# Altium schematic sheet 12V_POWER_BULKHEAD.SchDoc
size A4
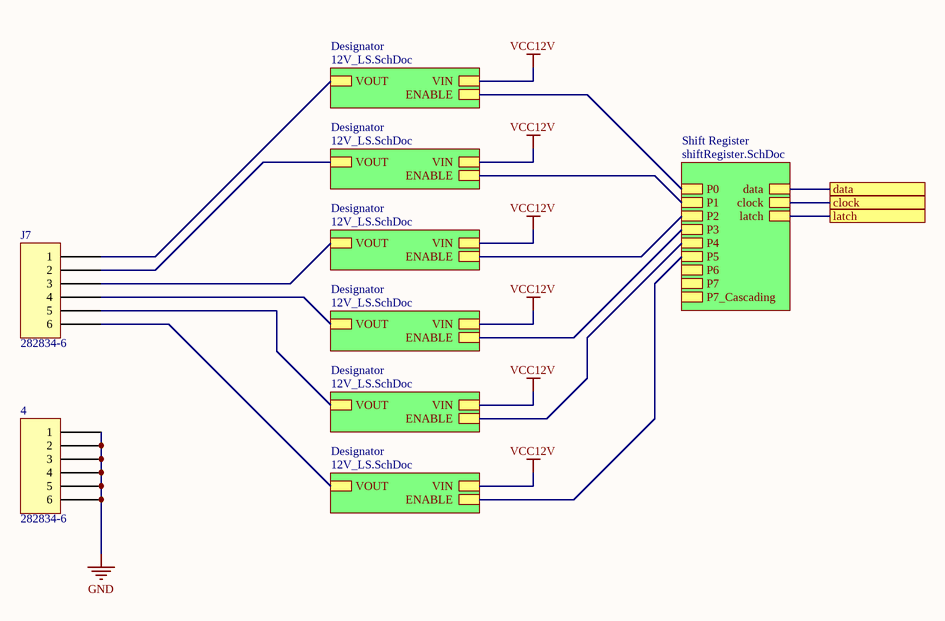
[diagram p0: 12V_POWER_BULKHEAD.SchDoc]

## Parts
4  282834-6  [TE 282834-6]
J7  282834-6  [TE 282834-6]

## Sub-sheets
Designator = 12V_LS.SchDoc: VOUT, ENABLE, VIN
Designator = 12V_LS.SchDoc: VOUT, ENABLE, VIN
Designator = 12V_LS.SchDoc: VOUT, ENABLE, VIN
Designator = 12V_LS.SchDoc: VOUT, ENABLE, VIN
Designator = 12V_LS.SchDoc: VOUT, ENABLE, VIN
Designator = 12V_LS.SchDoc: VOUT, ENABLE, VIN
Shift Register = shiftRegister.SchDoc: P0, P1, P2, P3, P4, P5, P6, P7, P7_Cascading, data, clock, latch

## Ports
clock, data, latch

## Nets
GND: 4.1 4.2 4.3 4.4 4.5 4.6
VCC12V: sheet Designator/VIN, sheet Designator/VIN, sheet Designator/VIN, sheet Designator/VIN, sheet Designator/VIN, sheet Designator/VIN
clock: port clock, sheet Shift Register/clock
data: port data, sheet Shift Register/data
latch: port latch, sheet Shift Register/latch
NetJ7_1: J7.1 ; sheet Designator/VOUT
NetJ7_2: J7.2 ; sheet Designator/VOUT
NetJ7_3: J7.3 ; sheet Designator/VOUT
NetJ7_4: J7.4 ; sheet Designator/VOUT
NetJ7_5: J7.5 ; sheet Designator/VOUT
NetJ7_6: J7.6 ; sheet Designator/VOUT
(unnamed): sheet Shift Register/P0, sheet Designator/ENABLE
(unnamed): sheet Shift Register/P1, sheet Designator/ENABLE
(unnamed): sheet Shift Register/P2, sheet Designator/ENABLE
(unnamed): sheet Shift Register/P3, sheet Designator/ENABLE
(unnamed): sheet Shift Register/P4, sheet Designator/ENABLE
(unnamed): sheet Shift Register/P5, sheet Designator/ENABLE

## Library data of the parts
4 J7 = 282834-6: TERM BLK 6P SIDE ENT 2.54MM PCB; Manufacturer: TE Connectivity AMP Connectors; Current: 10A; Mating Orientation: Horizontal with Board; Number of Levels: 1; Pitch: 0.100" (2.54mm); Positions Per Level: 6; Voltage: 150V; Wire Gauge: 16-30 AWG; Wire Termination: Screw - Rising Cage Clamp; Part Number: 282834-6; Color: Green; ComponentLink1Description: Datasheet; ComponentLink1URL: https://www.te.com/commerce/DocumentDelivery/DDEController?Action=srchrtrv&DocNm=282834&DocType=Customer+Drawing&DocLang=English; ComponentLink2Description: DigiKey Link; ComponentLink2URL: http://digikey.com/product-detail/en/te-connectivity-amp-connectors/282834-6/A98337-ND/1153267; LastUpdated: 2020-01-15 4:16:31 AM; Lifecycle Status: Active; Minimum Order: 1; Mounting Type: Through Hole; Packaging: Bulk; Part Status: Active; Price: 4.72; Series: Buchanan; Supplier 1: DigiKey; Supplier Part Number 1: A98337-ND